# EAGLE design LIXIE_II_Main_V4 (EAGLE 9.6.2)
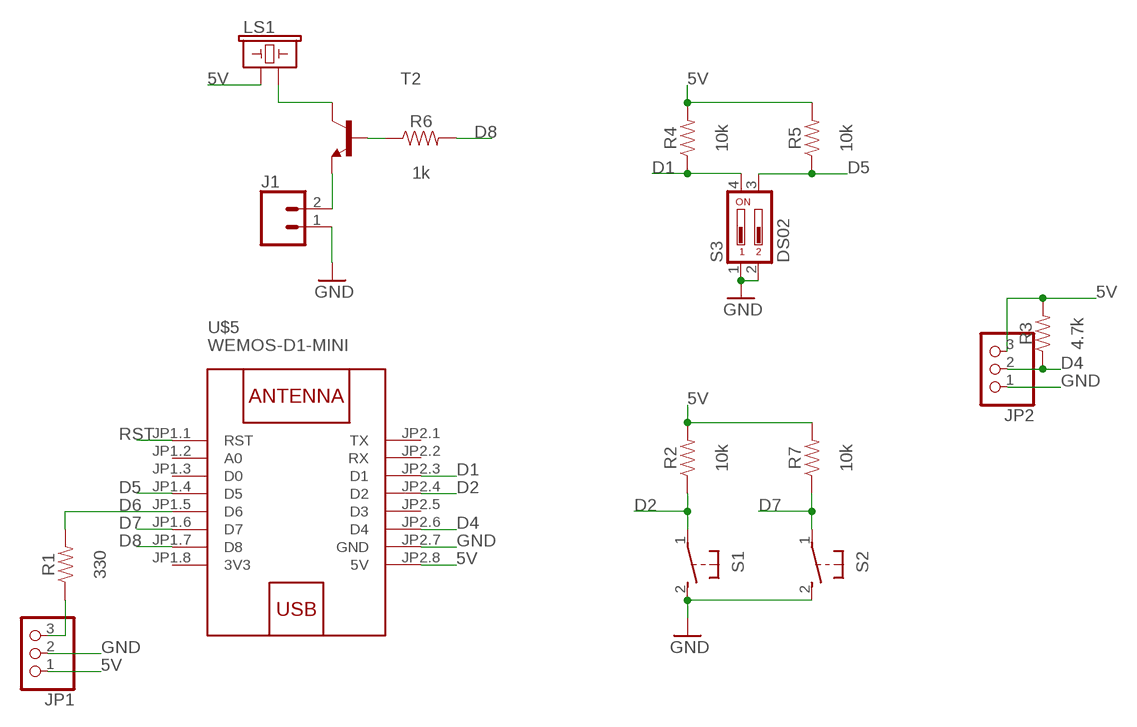
[diagram p0: schematic, sheet 1]

## Parts
J1  CONN_02  [1X02]
JP1  PINHD-1X3  [1X03]
JP2  PINHD-1X3  [1X03]
LS1  BUZZER-PTH  [BUZZER-12MM]
R1  330  0.3OHM-0805-1/8W-1%  [0805]
R2  10k  0.3OHM-0805-1/8W-1%  [0805]
R3  4.7k  0.3OHM-0805-1/8W-1%  [0805]
R4  10k  0.3OHM-0805-1/8W-1%  [0805]
R5  10k  0.3OHM-0805-1/8W-1%  [0805]
R6  1k  0.3OHM-0805-1/8W-1%  [0805]
R7  10k  0.3OHM-0805-1/8W-1%  [0805]
S1  31-XX  [B3F-31XX]
S2  31-XX  [B3F-31XX]
S3  DS02  [DS-02]
T2  -NPN-SOT23-EBC  [SOT23-EBC]
U$5  WEMOS-D1-MINI  [WEMOS-D1-MINI]

## Nets
5V: JP1.1 JP2.3 LS1.+ R2.2 R3.2 R4.2 R5.2 R7.2 U$5.JP2.8(5V)
D1: R4.1 S3.4 U$5.JP2.3(D1)
D2: R2.1 S1.1(P) U$5.JP2.4(D2)
D4: JP2.2 R3.1 U$5.JP2.6(D4)
D5: R5.1 S3.3 U$5.JP1.4(D5)
D6: R1.2 U$5.JP1.5(D6)
D7: R7.1 S2.1(P) U$5.JP1.6(D7)
D8: R6.2 U$5.JP1.7(D8)
GND: J1.1 JP1.2 JP2.1 S1.2(S) S2.2(S) S3.1 S3.2 U$5.JP2.7(GND)
N$1: LS1.- T2.C
N$2: J1.2 T2.E
N$3: JP1.3 R1.1
N$5: R6.1 T2.B
RST: U$5.JP1.1(RST)
Unconnected: U$5.JP1.2(A0) U$5.JP1.3(D0) U$5.JP2.1(TX) U$5.JP2.2(RX) U$5.JP2.5(D3)

## Power pins joined to a net without a drawn wire
3V3: U$5.JP1.8(3V3)

## Library data of the parts
J1 = SparkFun-Connectors:CONN_02: Multi connection point. Often used as Generic Header-pin footprint for 0.1 inch spaced/style header connections On any of the 0.1 inch spaced packages, you can populate with these: Break Away Headers - Straight <https://www.sparkfun.com/products/116> (PRT-00116) Break Away Male Headers - Right Angle <https://www.sparkfun.com/products/553> (PRT-00553) Female Headers <https://www.sparkfun.com/products/115> (PRT-00115) Break Away Headers - Machine Pin <https://www.sparkfun.com/products/117> (PRT-00117) Break Away Female Headers - Swiss Machine Pin <https://www.sparkfun.com/products/743> (PRT-00743) For SCREWTERMINALS and SPRING TERMINALS visit here: Screw Terimnals on SparkFun.com <https://www.sparkfun.com/search/results?term=Screw+Terminals> (5mm/3.5mm/2.54mm spacing) This device is also useful as a general connection point to wire up your design to another part of your project. Our various solder wires solder well into these plated through hole pads. Hook-Up Wire - Assortment (Stranded, 22 AWG) <https://www.sparkfun.com/products/11375> (PRT-11375) Hook-Up Wire - Assortment (Solid Core, 22 AWG) <https://www.sparkfun.com/products/11367> (PRT-11367) View the entire wire category on our website here <https://www.sparkfun.com/categories/141> Special notes: Molex polarized connector foot print use with: PRT-08233 with associated crimp pins and housings. 2.54_SCREWTERM for use with PRT-10571. 3.5mm Screw Terminal footprints for PRT-08084 5mm Screw Terminal footprints for use with PRT-08432
JP1 JP2 = pinhead:PINHD-1X3: PIN HEADER
LS1 = SparkFun-Electromechanical:BUZZER: Buzzer Small round buzzers that operate around the audible 2kHz range. You can use these as speakers to create simple music or user interfaces. Variant Overview: PTH - Mini Speaker - PC Mount 12mm 2.048kHz <https://www.sparkfun.com/products/7950> PTH_KIT - Mini Speaker - PC Mount 12mm 2.048kHz <https://www.sparkfun.com/products/7950> KIT simplifies soldering by adding stop mask to one side of the pads. PTH_NO_SILK - Mini Speaker - PC Mount 12mm 2.048kHz <https://www.sparkfun.com/products/7950> No silkscreen indicator of buzzer outline. PTH_KIT_NO_SILK - Mini Speaker - PC Mount 12mm 2.048kHz <https://www.sparkfun.com/products/7950> KIT package w/o silkscreen SMD - Buzzer Audio Magnetic (CCV-084B16) SMD buzzer used on, e.g. the LilyPad Buzzer <https://www.sparkfun.com/products/8463> and RFID USB Reader <https://www.sparkfun.com/products/9963>. SMD_KIT - Buzzer Audio Magnetic (CCV-084B16) SMD Buzzer with elongated pins to make soldering easier. Used on the SparkFun Simon Says - Surface Mount Soldering Kit <https://www.sparkfun.com/products/10935>.; PROD_ID: COMP-08253; SF_SKU: COM-07950
R1-R7 = SparkFun-Resistors:0.3OHM: 0.3Ω resistor A resistor is a passive two-terminal electrical component that implements electrical resistance as a circuit element. Resistors act to reduce current flow, and, at the same time, act to lower voltage levels within circuits. - Wikipedia; PROD_ID: RES-11622; VALUE: 0.3
S1 S2 = adafruit:31-XX: OMRON SWITCH Now with beefier pads!
S3 = Switch:DS02: DIL/CODE SWITCH; CATEGORY: SWITCH; MPN: MCNDS02; TYPE: SPST
T2 = transistor:*-NPN-: NPN Transistror BF959 corrected 2008.03.06
U$5 = diy-modules:WEMOS-D1-MINI: WEMOS D1 mini: Mini Wi-Fi Board based on ESP-8266 device More details can be found here: https://www.wemos.cc/product/d1-mini.html Click here to find device on ebay.com <http://www.ebay.com/sch/wemos+d1+mini+nodemcu>

## Board
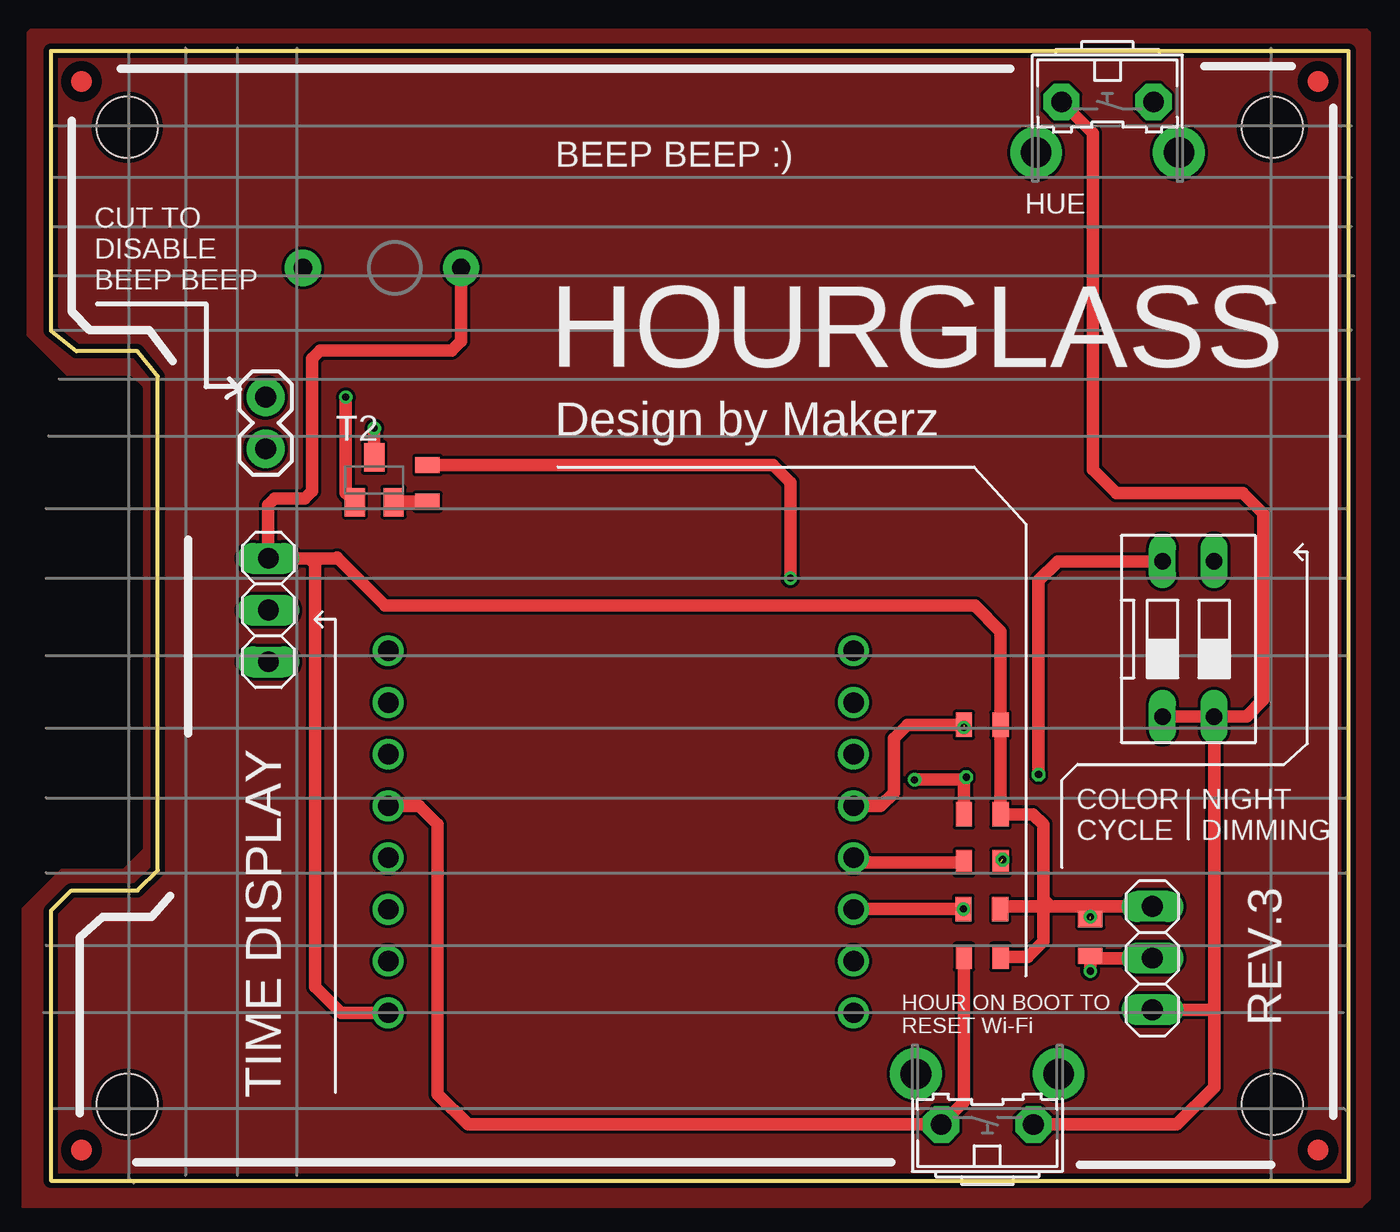
[diagram p1: board, top side]
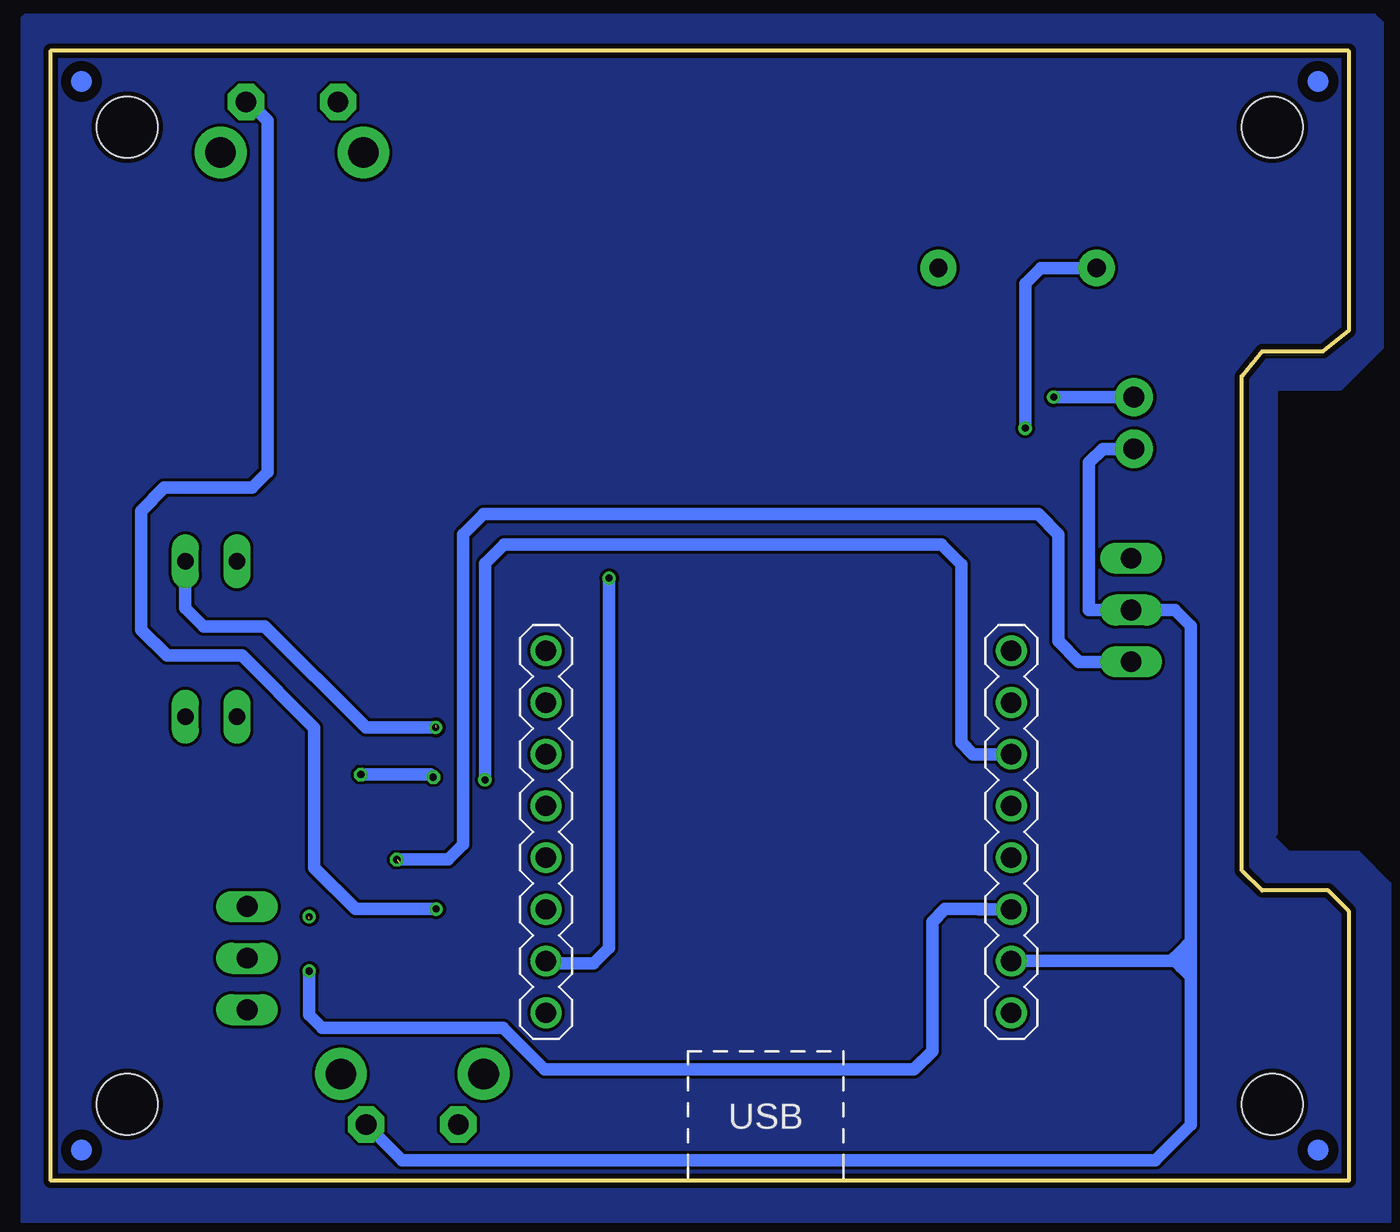
[diagram p2: board, bottom side, seen from below]

Size 63.75 x 55.5 mm. Coordinates in mm from the lower left corner, seen from the top.
Outline: 63.75,0 63.75,55.5 0,55.5 0,41.75 1.25,40.75 4.25,40.75 5.25,39.5 5.25,15.25 4.25,14.25 1,14.25 0,13.25 0,0 63.75,0
Copper layers (1*16): Top 0.035mm / dielectric 1.5mm / Bottom 0.035mm
Design rules "dirt_cheap_dirty_boards.v1.1": minimum track width 6mil, minimum drill 12mil, track to track 6mil, track to pad 6mil, pad to pad 6mil, via to via 6mil, smd to smd 0mil, copper to edge 10mil, drill to drill 10mil, minimum pad ring 10mil, minimum via ring 6mil, stop-mask expansion 2mil, vias tented up to drill 25mil, thermal gap 10mil
Holes 3 mm at 3.75,3.75 60,3.75 60,51.75 3.75,51.75

### Footprints (pad centres in the part's own frame; a part is rotated, then mirrored left to right if it is on the bottom)
1X02 = drill 1.016 pad 1.88: 1 0,0; 2 2.54,0
1X03 = drill 1.016 long: 1 -2.54,0; 2 0,0; 3 2.54,0
BUZZER-12MM = drill 0.9 pad 1.778: + 3.25,0; - -4.52,0
0805 = smd 0.8 x 1.2: 1 -0.9,0; 2 0.9,0
B3F-31XX = drill 1.016 pad 1.778 octagon: 1 -2.261,-1.245; 2 2.261,-1.245 | drill 1.499 pad 2.54: 3 -3.505,1.245; 4 3.505,1.245
DS-02 = drill 0.813 long: 1 -1.27,-3.81; 2 1.27,-3.81; 3 1.27,3.81; 4 -1.27,3.81
SOT23-EBC = smd 1 x 1.4: B 0.95,-1.1; C 0,1.1; E -0.95,-1.1
WEMOS-D1-MINI = drill 1: JP1.1 -11.43,9.525; JP1.2 -11.43,6.985; JP1.3 -11.43,4.445; JP1.4 -11.43,1.905; JP1.5 -11.43,-0.635; JP1.6 -11.43,-3.175; JP1.7 -11.43,-5.715; JP1.8 -11.43,-8.255; JP2.1 11.43,9.525; JP2.2 11.43,6.985; JP2.3 11.43,4.445; JP2.4 11.43,1.905; JP2.5 11.43,-0.635; JP2.6 11.43,-3.175; JP2.7 11.43,-5.715; JP2.8 11.43,-8.255

### Placement (x,y rotation side)
J1  10.55,35.95 90 top
JP1  10.68,28.03 270 top
JP2  54.11,10.93 90 top
LS1  16.9,44.84 0 top
R1  45.75,15.64 180 top
R2  45.75,11 0 top
R3  51.06,11.95 90 top
R4  45.75,18 0 top
R5  45.75,22.39 0 top
R6  18.5,34.25 90 top
R7  45.73,13.34 0 top
S1  46,4 0 top
S2  51.91,51.75 180 top
S3  55.88,26.61 0 top
T2  15.88,34.42 0 top
U$1  [CIRCLE-1MM-2R]  1.5,1.5 0 top
U$2  [CIRCLE-1MM-2R]  1.5,54 0 top
U$3  [CIRCLE-1MM-2R]  62.25,54 0 top
U$4  [CIRCLE-1MM-2R]  62.25,1.5 0 top
U$5  28,16.5 0 bottom

### Tracks (layer width: path | path; a pad name or v marks a point on that pad's centre or on a via)
5V  (via drill 0.35)  (1 unrouted)
  Top 0.61: R2.2 48,11 48.75,11.75 48.75,13.85 | 48.75,13.85 48.75,17.5 48.25,18 R4.2 R5.2 46.65,26.99 45.4,28.24 16.41,28.24 14.05,30.61 14.01,30.57 JP1.1 | JP1.1 10.68,33.18 11,33.5 12.45,33.5 12.84,33.88 12.84,40.39 13.22,40.77 19.69,40.77 20.15,41.23 LS1.+ | JP1.1 12.68,30.57 12.99,30.26 12.99,9.51 14.26,8.24 U$5.JP2.8 | 48.75,13.85 49.13,13.47 | 49.13,13.47 51.06,13.47 | 51.06,13.47 JP2.3 | R3.2 51.06,13.47 | R7.2 46.76,13.47 49.13,13.47
  other vias: 51.06,12.96
B
  pour Bottom: -1.64,56.9 -1.64,40.9 0.39,38.87 3.56,38.87 3.56,17.03 3.69,16.9 2.93,16.14 -0.5,16.14 -2.02,14.61 -2.02,-2.02 65.16,-2.02 65.16,57.12 64.99,57.28 -1.26,57.28
D1  (via drill 0.35)
  Top 0.61: v48.52,19.95 48.52,29.47 49.47,30.42 S3.4 | v42.43,19.69 42.44,19.7 44.85,19.7 | R4.1 44.85,19.7 | 44.85,19.7 v44.97,19.82
  Bottom 0.61: U$5.JP2.3 18.45,20.95 19.03,21.53 19.03,30.28 20,31.25 41.5,31.25 42.43,30.32 v42.43,19.69 | v44.97,19.82 45.09,19.95 v48.52,19.95
D2
  Top 0.61: R2.1 44.85,3.87 S1.1 20.5,2.75 19,4.25 19,17.5 18.09,18.41 U$5.JP2.4
D4  (via drill 0.35)
  Top 0.61: JP2.2 51.18,10.93 R3.1 v51.06,10.29
  Bottom 0.61: 17.79,13.34 18.17,13.34 | 18.17,13.34 19.82,13.34 20.45,12.71 20.45,6.36 21.34,5.47 39.51,5.47 41.54,7.5 50.43,7.5 51.06,8.14 v51.06,10.29 | 18.17,13.34 18.15,13.32 U$5.JP2.6
D5  (via drill 0.35)  (1 unrouted)
  Top 0.61: U$5.JP1.4 40.76,18.41 41.41,19.06 41.41,21.73 42.07,22.39 R5.1
  Bottom 0.61: S3.3 57.15,28.14 56.25,27.23 53.24,27.23 48.27,22.26 v44.85,22.26
D6
  Top 0.61: R1.2 39.65,15.64 U$5.JP1.5
D7  (via drill 0.35)
  Top 0.61: R7.1 39.45,13.34 U$5.JP1.6
  Bottom 0.61: R7.1 48.78,13.34 50.81,15.38 50.81,22.23 54.36,25.79 58.05,25.79 59.32,27.06 59.32,32.9 58.17,34.04 53.86,34.04 53.09,34.81 53.09,52.08 54.01,52.99 S2.1
  other vias: 44.83,13.34
D8  (via drill 0.35)
  Top 0.61: R6.2 35.48,35.15 36.33,34.3 v36.33,29.6
  Bottom 0.61: v36.33,29.6 36.33,11.44 37.09,10.68 39.32,10.68 U$5.JP1.7
GND
  Top 0.61: S1.2 55.31,2.75 57.15,4.59 57.15,8.26 | JP2.1 57.02,8.39 57.15,8.26 | 57.15,8.26 S3.2 | S3.1 S3.2 | S2.2 51.19,51.45 51.19,34.93 52.33,33.79 58.55,33.79 59.57,32.77 59.57,23.63 58.74,22.8 S3.2
  Bottom 0.61: 7.75,11.75 7.75,27.25 8.53,28.03 JP1.2 12.75,28.03 12.75,35.27 12.07,35.95 J1.1 | 8.71,10.79 8.25,11.25 | 8.25,11.25 7.75,11.75 | 8.71,10.79 U$5.JP2.7 | S1.2 46.51,1 9.5,1 7.75,2.75 7.75,10 | 7.75,11.75 7.75,10 | 7.75,10 8.25,10.5 | 8.25,10.5 8.54,10.79 8.71,10.79 | 8.25,10.5 8.25,11.25
N$1  (via drill 0.35)
  Top 0.61: v15.88,36.97 T2.C
  Bottom 0.61: v15.88,36.97 15.88,44.08 15.12,44.84 LS1.-
N$2  (via drill 0.35)
  Top 0.61: v14.49,38.49 14.49,33.77 T2.E
  Bottom 0.61: v14.49,38.49 J1.2
N$3  (via drill 0.35)  (1 unrouted)
  Bottom 0.61: v46.75,15.77 44.25,15.77 43.5,16.52 43.5,31.75 42.5,32.75 15.25,32.75 14.25,31.75 14.25,26.5 13.24,25.49 JP1.3
N$5
  Top 0.61: 18.45,33.4 R6.1 16.86,33.35 T2.B
T
  pour Top: -1.14,55.63 -1.14,41.54 -0.12,40.52 0.77,39.63 3.95,39.63 4.58,39 4.58,16.26 3.56,15.25 3.18,15.25 0.52,15.25 -1.01,13.72 -1.39,13.34 -1.39,-1.26 64.4,-1.26 64.78,-0.88 64.78,56.4 64.65,56.52 -1.01,56.52 -1.14,56.4

### Text on the board
tNames: BEEP BEEP :) | HUE | CUT TO / DISABLE / BEEP BEEP | HOURGLASS | Design by Makerz | COLOR / CYCLE | NIGHT / DIMMING | HOUR ON BOOT TO / RESET Wi-Fi | REV.3 | TIME DISPLAY